# EAGLE design Logic_Level_Bidirectional (EAGLE 7.6.0)
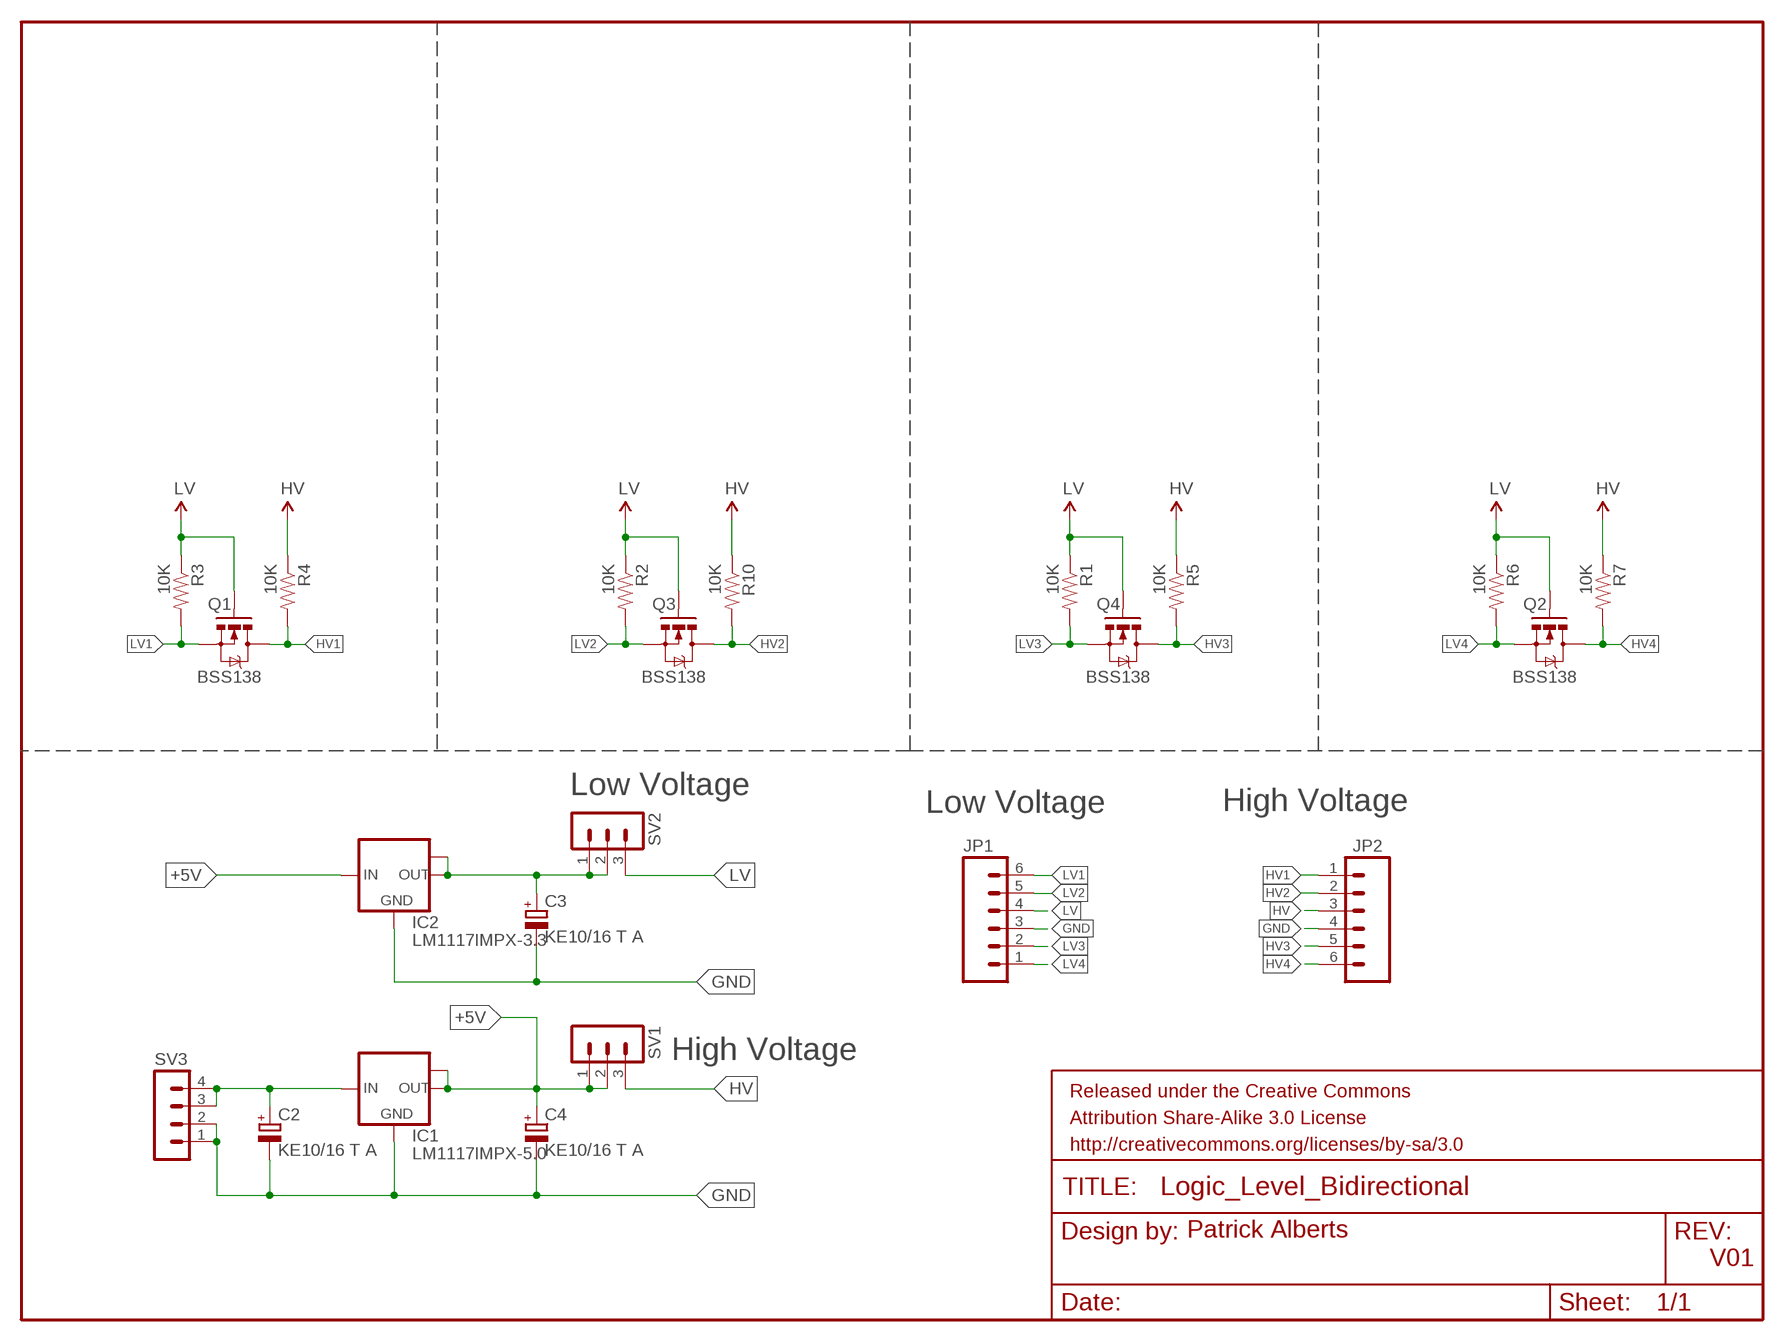
[diagram p0: schematic, sheet 1]

## Parts
C2  KE10/16 T A  CPOL-EUSMCA  [SMC_A]
C3  KE10/16 T A  CPOL-EUSMCA  [SMC_A]
C4  KE10/16 T A  CPOL-EUSMCA  [SMC_A]
IC1  LM1117IMPX-5.0  [SOT223]
IC2  LM1117IMPX-3.3  [SOT223]
JP1  M06SIP  [1X06]
JP2  M06SIP  [1X06]
Q1  BSS138  MOSFET-NCHANNELSMD  [SOT23-3]
Q2  BSS138  MOSFET-NCHANNELSMD  [SOT23-3]
Q3  BSS138  MOSFET-NCHANNELSMD  [SOT23-3]
Q4  BSS138  MOSFET-NCHANNELSMD  [SOT23-3]
R1  10K  RESISTOR0603-RES  [0603-RES]
R2  10K  RESISTOR0603-RES  [0603-RES]
R3  10K  RESISTOR0603-RES  [0603-RES]
R4  10K  RESISTOR0603-RES  [0603-RES]
R5  10K  RESISTOR0603-RES  [0603-RES]
R6  10K  RESISTOR0603-RES  [0603-RES]
R7  10K  RESISTOR0603-RES  [0603-RES]
R10  10K  RESISTOR0603-RES  [0603-RES]
SV1  MA03-1  [MA03-1]
SV2  MA03-1  [MA03-1]
SV3  MA04-1  [MA04-1]

## Nets
+3.3V: C3.+ IC2.2(OUT) IC2.TAB(OUT1) SV2.1 SV2.2
+5V: C4.+ IC1.2(OUT) IC1.TAB(OUT1) IC2.3(IN) SV1.1 SV1.2
GND: C2.- C3.- C4.- IC1.1(GND) IC2.1(GND) JP1.3 JP2.4 SV3.1 SV3.2
HV: JP2.3 R4.1 R5.1 R7.1 R10.1 SV1.3
HV1: JP2.1 Q1.3(D) R4.2
HV2: JP2.2 Q3.3(D) R10.2
HV3: JP2.5 Q4.3(D) R5.2
HV4: JP2.6 Q2.3(D) R7.2
LV: JP1.4 Q1.1(G) Q2.1(G) Q3.1(G) Q4.1(G) R1.1 R2.1 R3.1 R6.1 SV2.3
LV1: JP1.6 Q1.2(S) R3.2
LV2: JP1.5 Q3.2(S) R2.2
LV3: JP1.2 Q4.2(S) R1.2
LV4: JP1.1 Q2.2(S) R6.2
N$8: C2.+ IC1.3(IN) SV3.3 SV3.4

## Notes on the sheet
- Low Voltage
- Low Voltage | High Voltage
- High Voltage
- Patrick Alberts
- V01

## Library data of the parts
C2-C4 = rcl:CPOL-EU: POLARIZED CAPACITOR, European symbol
IC1 IC2 = lm1117:LM1117IMPX-*
JP1 JP2 = SparkFun:M06: Header 6 Standard 6-pin 0.1" header. Use with straight break away headers (SKU : PRT-00116), right angle break away headers (PRT-00553), swiss pins (PRT-00743), machine pins (PRT-00117), and female headers (PRT-00115). Molex polarized connector foot print use with SKU : PRT-08094 with associated crimp pins and housings. NOTES ON THE VARIANTS LOCK and LOCK_LONGPADS... This footprint was designed to help hold the alignment of a through-hole component (i.e. 6-pin header) while soldering it into place. You may notice that each hole has been shifted either up or down by 0.005 of an inch from it's more standard position (which is a perfectly straight line). This slight alteration caused the pins (the squares in the middle) to touch the edges of the holes. Because they are alternating, it causes a "brace" to hold the component in place. 0.005 has proven to be the perfect amount of "off-center" position when using our standard breakaway headers. Although looks a little odd when you look at the bare footprint, once you have a header in there, the alteration is very hard to notice. Also, if you push a header all the way into place, it is covered up entirely on the bottom side. This idea of altering the position of holes to aid alignment will be further integrated into the Sparkfun Library for other footprints. It can help hold any component with 3 or more connection pins.
Q1-Q4 = SparkFun:MOSFET-NCHANNEL
R1-R7 R10 = SparkFun:RESISTOR: Resistor Basic schematic elements and footprints for 0603, 1206, and PTH resistors.
SV1 SV2 = con-lstb:MA03-1: PIN HEADER; OC_FARNELL: unknown; OC_NEWARK: unknown
SV3 = con-lstb:MA04-1: PIN HEADER; OC_FARNELL: unknown; OC_NEWARK: unknown

## Board
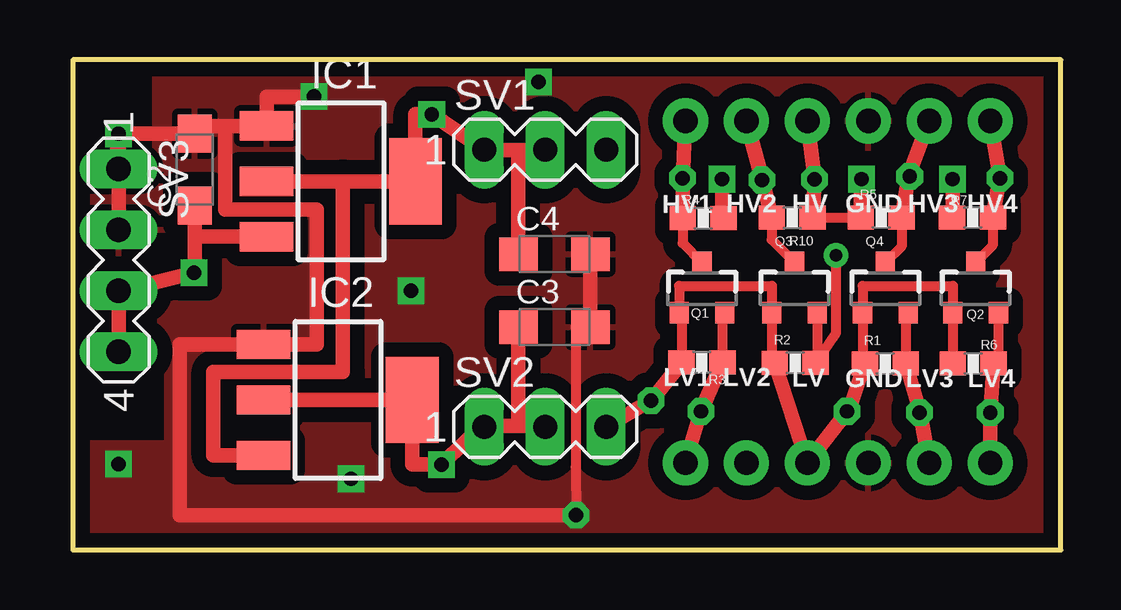
[diagram p1: board, top side]
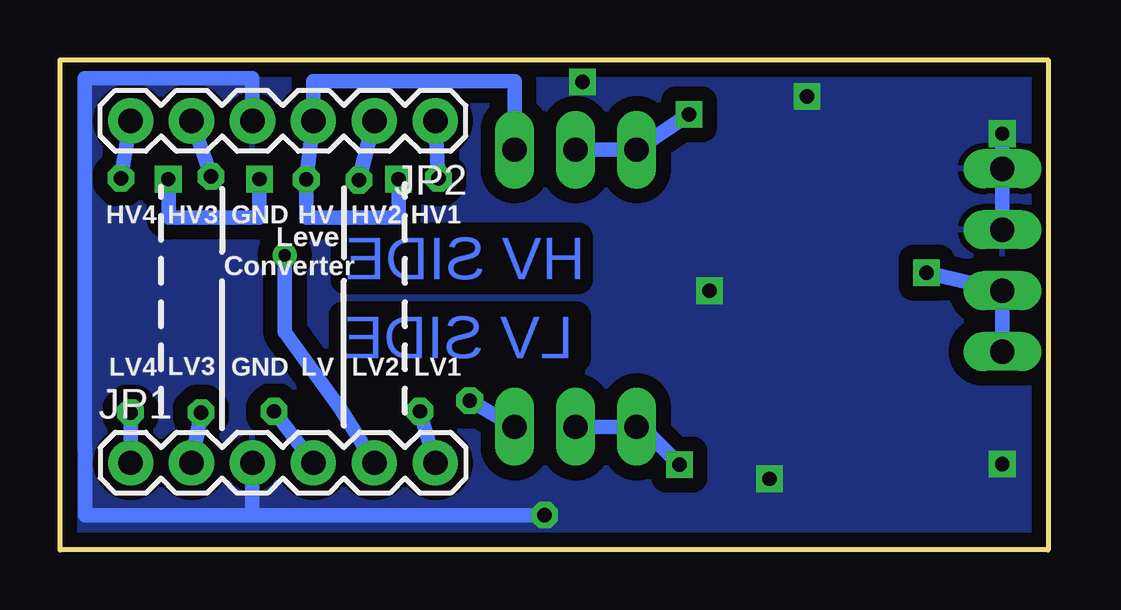
[diagram p2: board, bottom side, seen from below]

Size 41.17 x 20.43 mm. Coordinates in mm from the lower left corner, seen from the top.
Outline: 0,0 41.17,0 41.17,20.43 0,20.43 0,0
Copper layers (1*16): Top 0.035mm / dielectric 1.5mm / Bottom 0.035mm
Design rules "SparkFun *": minimum track width 7mil, minimum drill 15mil, track to track 8mil, track to pad 8mil, pad to pad 8mil, via to via 8mil, smd to smd 8mil, copper to edge 8mil, drill to drill 8mil, minimum pad ring 12mil, minimum via ring 10mil, stop-mask expansion 4mil, vias tented up to drill 20mil, thermal gap 10mil

### Footprints (pad centres in the part's own frame; a part is rotated, then mirrored left to right if it is on the bottom)
SMC_A = smd 1.6 x 1.4: + -1.5,0; - 1.5,0
SOT223 = smd 1.219 x 2.235: 1 -2.311,-3.099; 2 0,-3.099; 3 2.311,-3.099 | smd 3.6 x 2.2: TAB 0,3.099
1X06 = drill 1.016 pad 1.88: 1 0,0; 2 2.54,0; 3 5.08,0; 4 7.62,0; 5 10.16,0; 6 12.7,0
SOT23-3 = smd 0.8 x 0.9: 1 -0.95,-1; 2 0.95,-1; 3 0,1.1
0603-RES = smd 1.1 x 1: 1 -0.85,0; 2 0.85,0
MA03-1 = drill 1.016 long: 1 -2.54,0; 2 0,0; 3 2.54,0
MA04-1 = drill 1.016 long: 1 -3.81,0; 2 -1.27,0; 3 1.27,0; 4 3.81,0

### Placement (x,y rotation side)
C2  5.08,15.86 90 top
C3  20.07,9.29 0 top
C4  20.07,12.33 0 top
IC1  11.18,15.37 270 top
IC2  11.05,6.25 270 top
JP1  38.23,3.63 0 bottom
JP2  25.53,17.89 180 bottom
Q1  26.21,10.89 0 top
Q2  37.62,10.89 0 top
Q3  30.07,10.89 0 top
Q4  33.86,10.89 0 top
R1  33.86,7.77 0 top
R2  30.1,7.79 0 top
R3  26.21,7.82 0 top
R4  26.26,13.83 180 top
R5  33.68,13.85 0 top
R6  37.52,7.77 0 top
R7  37.49,13.85 0 top
R10  29.97,13.85 180 top
SV1  19.69,16.69 0 top
SV2  19.69,5.13 0 top
SV3  1.91,12.08 270 top

### Tracks (layer width: path | path; a pad name or v marks a point on that pad's centre or on a via)
+3.3V  (via drill 0.6)
  Top 0.61: IC2.2 IC2.TAB 14.15,3.56 v15.36,3.56 17.06,5.16 18.86,5.16 | 18.86,5.16 19.66,5.16 | C3.+ 18.57,5.45 18.86,5.16
  Bottom 0.61: SV2.2 SV2.1 16.93,5.13 v15.36,3.56
+5V  (via drill 0.6)
  Top 0.61: IC1.2 11.26,15.37 | 11.26,15.37 IC1.TAB 14.28,18.16 v14.96,18.16 17.16,16.66 18.46,16.66 | 18.46,16.66 19.66,16.66 | C4.+ 18.57,16.55 arc90 18.46,16.66 | IC2.3 5.86,3.94 5.86,7.41 11.26,7.41 11.26,15.37
  Bottom 0.61: SV1.2 SV1.1 v14.96,18.16
GND  (via drill 0.6)
  Top 0.406: C3.- 20.96,9.29 20.96,3.44 v20.97,1.44
  Top 0.61: SV3.1 SV3.2 | C4.- C3.- | v20.97,1.44 4.46,1.44 4.46,8.56 IC2.1 10.16,8.56 10.16,14.19 6.36,14.19 6.36,17.68 | 2.06,17.36 C2.- 5.4,17.68 6.36,17.68 | 2.06,17.36 v1.91,17.36 1.91,15.91 1.86,15.86 1.86,17.16 2.06,17.36 | 6.36,17.68 IC1.1 8.08,18.91 v10.05,18.91
  Bottom 0.406: 40.13,4.22 40.11,4.22
  Bottom 0.61: SV3.2 SV3.1 v1.91,17.36 | 40.13,4.22 40.13,19.67 33.15,19.67 JP2.4 | 33.15,1.44 40.11,1.44 40.11,4.22 | 33.15,1.44 v20.97,1.44 | JP1.3 33.15,1.44
  other vias: 1.91,3.57 14.1,10.81 19.4,19.51 11.6,2.96
  pour Top (isolate 0.61): -0.13,16.4 3.43,16.4 3.43,20.43 21.72,20.43 21.62,20.39 41.09,20.39 41.27,-0.01 21.59,-0.01 21.59,0 0.1,0 0,4.46 3.94,4.46 3.94,8.27 0,8.27
  pour Bottom (isolate 0.61): 0,20.43 41.17,20.43 41.27,0 0.1,0
HV  (via drill 0.6)
  Top 0.406: R10.1 R5.1
  Top 0.61: R10.1 v30.91,15.45 JP2.3 | R4.1 27.06,13.82 v27.06,15.46 | R5.1 32.83,15.36 v32.86,15.46 | v36.66,15.46 36.66,13.85 R7.1
  Bottom 0.61: SV1.3 22.23,19.54 30.61,19.54 JP2.3 v30.91,15.45 30.91,13.85 27.06,13.85 v27.06,15.46 | v32.86,15.46 32.86,13.85 R7.1 36.64,15.46 v36.66,15.46
HV1  (via drill 0.6)
  Top 0.406: R4.2 25.41,12.78 Q1.3
  Top 0.61: JP2.1 25.41,15.39 R4.2
  Bottom 0.61: v25.4,15.49 JP2.1
HV2  (via drill 0.6)
  Top 0.406: 29.98,12.08 Q3.3 29.12,12.94 R10.2
  Top 0.61: JP2.2 28.72,15.43 R10.2
  Bottom 0.61: v28.71,15.42 JP2.2
HV3  (via drill 0.6)
  Top 0.406: R5.2 34.53,12.66 Q4.3
  Top 0.61: R5.2 34.83,15.63 JP2.5
  Bottom 0.61: v34.87,15.57 JP2.5
HV4  (via drill 0.6)
  Top 0.254: Q2.3 37.91,11.98 | 38.33,13.44 R7.2
  Top 0.406: 38.33,13.44 38.33,12.7 Q2.3
  Top 0.61: JP2.6 38.63,15.56 R7.2
  Bottom 0.61: v38.63,15.49 JP2.6
LV  (via drill 0.6)
  Top 0.254: 25.36,9.79 Q1.1 | 36.43,9.88 Q2.1 36.51,9.88 | 32.91,10.14 Q4.1
  Top 0.406: 25.36,9.79 R3.1 | R2.1 29.12,8.32 Q3.1 29.12,11.01 25.26,11.01 Q1.1 | Q2.1 | R1.1 32.91,8.17 Q4.1 32.91,11.01 36.67,11.01 Q2.1 | Q2.1 R6.1
  Top 0.61: SV2.3 24.14,6.27 R3.1 | R1.1 32.38,5.9 JP1.4 R2.1
  Bottom 0.61: v32.25,5.77 JP1.4 | v24.1,6.23 SV2.3
LV1  (via drill 0.6)
  Top 0.254: 27.06,9.79 Q1.2
  Top 0.406: 27.06,9.79 R3.2
  Top 0.61: R3.2 v26.16,5.76 JP1.6
  Bottom 0.61: v26.17,5.77 JP1.6
LV2  (via drill 0.51)
  Top 0.406: Q3.2 31.02,8.27 R2.2 31.8,9.04 v31.8,12.28
  Bottom 0.61: v31.8,12.28 31.8,9.08 29.45,5.83 JP1.5
LV3  (via drill 0.6)
  Top 0.406: Q4.2 34.71,9.79 R1.2
  Top 0.61: R1.2 35.29,5.79 JP1.2
  Bottom 0.61: v35.29,5.73 JP1.2
LV4  (via drill 0.6)
  Top 0.406: Q2.2 38.57,7.97 R6.2
  Top 0.61: R6.2 v38.23,5.73 JP1.1
  Bottom 0.61: v38.23,5.73 JP1.1
N$8  (via drill 0.6)
  Top 0.61: SV3.3 SV3.4 | IC1.3 5.08,13.05 C2.+ 5.08,11.66 | 5.08,11.66 5.08,11.56 1.86,10.76 | v5.06,11.56 5.06,11.66 5.08,11.66
  Bottom 0.61: SV3.4 SV3.3 4.81,11.51 v5.06,11.56

### Text on the board
Bottom: HV SIDE | LV SIDE
tPlace: HV1 | HV2 | HV | GND | HV3 | HV4 | LV1 | LV2 | LV | GND | LV3 | LV4
bPlace: HV1 | Level / Converter | HV2 | HV | GND | HV3 | HV4 | LV1 | LV2 | LV | GND | LV3 | LV4
tValues: Nathan Seidle | Rev V13 by Patrick Alberts